# EAGLE design mainboard (EAGLE 6.4)
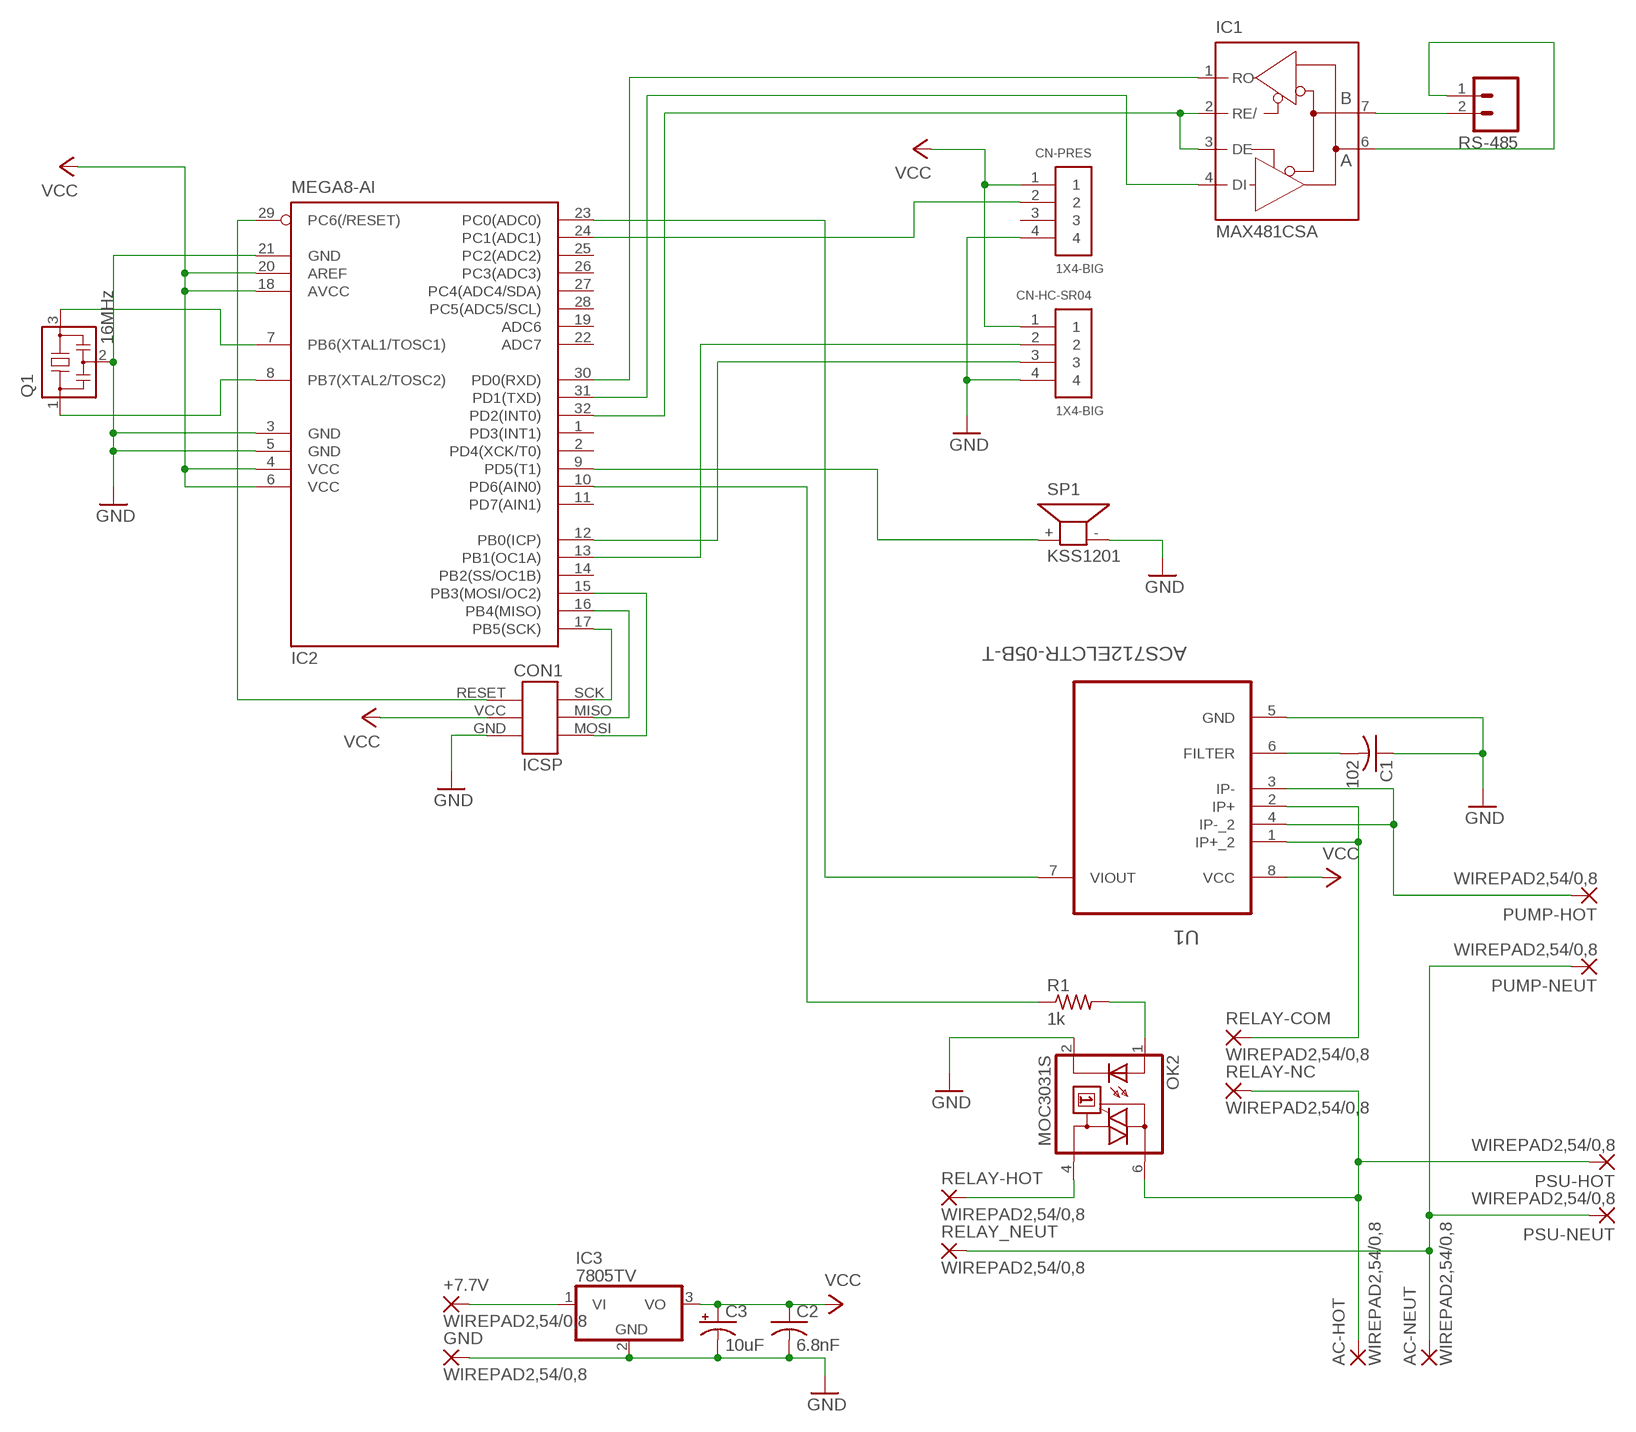
[diagram p0: schematic, sheet 1]

## Parts
+7.7V  WIREPAD2,54/0,8  [2,54/0,8]
AC-HOT  WIREPAD2,54/0,8  [2,54/0,8]
AC-NEUT  WIREPAD2,54/0,8  [2,54/0,8]
C1  102  C-US025-024X044  [C025-024X044]
C2  6.8nF  C-US050-024X044  [C050-024X044]
C3  10uF  CPOL-USE1.8-4  [E1,8-4]
CN-HC-SR04  1X4-BIG  [1X04-BIG]
CN-PRES  1X4-BIG  [1X04-BIG]
CON1  ICSP-HEADER  [ICSP-HEADER]
GND  WIREPAD2,54/0,8  [2,54/0,8]
IC1  MAX481CSA  [SO08]
IC2  MEGA8-AI  [TQFP32-08]
IC3  7805TV  [TO220V]
OK2  MOC3031S  [DIL6-SMD]
PSU-HOT  WIREPAD2,54/0,8  [2,54/0,8]
PSU-NEUT  WIREPAD2,54/0,8  [2,54/0,8]
PUMP-HOT  WIREPAD2,54/0,8  [2,54/0,8]
PUMP-NEUT  WIREPAD2,54/0,8  [2,54/0,8]
Q1  16MHz  RESONATOR  [RESONATOR]
R1  1k  R-US_R0603  [R0603]
RELAY-COM  WIREPAD2,54/0,8  [2,54/0,8]
RELAY-HOT  WIREPAD2,54/0,8  [2,54/0,8]
RELAY-NC  WIREPAD2,54/0,8  [2,54/0,8]
RELAY_NEUT  WIREPAD2,54/0,8  [2,54/0,8]
RS-485  M02  [02P]
SP1  KSS1201  [KSS1201]
U1  ACS712ELCTR-05B-T  [SOIC127P600X175-8N]

## Nets
GND: C1.1 C2.2 C3.- CN-HC-SR04.4 CN-PRES.4 CON1.GND GND.1(P) IC2.3(GND) IC2.5(GND) IC2.21(GND) IC3.2(GND) OK2.2(C) Q1.2 SP1.- U1.5(GND)
N$1: IC2.7(PB6(XTAL1/TOSC1)) Q1.3
N$2: IC2.8(PB7(XTAL2/TOSC2)) Q1.1
N$3: CON1.SCK IC2.17(PB5(SCK))
N$4: CON1.MISO IC2.16(PB4(MISO))
N$5: CON1.MOSI IC2.15(PB3(MOSI/OC2))
N$6: CON1.RESET IC2.29(PC6(/RESET))
N$7: C1.2 U1.6(FILTER)
N$8: PUMP-HOT.1(P) U1.3(IP-) U1.4(IP-_2)
N$9: +7.7V.1(P) IC3.1(VI)
N$10: AC-HOT.1(P) OK2.6(A2) PSU-HOT.1(P) RELAY-NC.1(P)
N$11: AC-NEUT.1(P) PSU-NEUT.1(P) PUMP-NEUT.1(P) RELAY_NEUT.1(P)
N$12: OK2.4(A1) RELAY-HOT.1(P)
N$13: IC2.9(PD5(T1)) SP1.+
N$14: IC2.23(PC0(ADC0)) U1.7(VIOUT)
N$15: OK2.1(A) R1.2
N$16: IC2.10(PD6(AIN0)) R1.1
N$17: CN-PRES.2 IC2.24(PC1(ADC1))
N$18: CN-HC-SR04.2 IC2.13(PB1(OC1A))
N$19: CN-HC-SR04.3 IC2.12(PB0(ICP))
N$20: IC1.7(B) RS-485.2
N$21: IC1.6(A) RS-485.1
N$22: IC1.2(RE/) IC1.3(DE) IC2.32(PD2(INT0))
N$23: IC1.1(RO) IC2.30(PD0(RXD))
N$24: IC1.4(DI) IC2.31(PD1(TXD))
RELAY-COM: RELAY-COM.1(P) U1.1(IP+_2) U1.2(IP+)
VCC: C2.1 C3.+ CN-HC-SR04.1 CN-PRES.1 CON1.VCC(+5V) IC2.4(VCC) IC2.6(VCC) IC2.18(AVCC) IC2.20(AREF) IC3.3(VO) U1.8(VCC)
Unconnected: CN-PRES.3 IC2.1(PD3(INT1)) IC2.2(PD4(XCK/T0)) IC2.11(PD7(AIN1)) IC2.14(PB2(SS/OC1B)) IC2.19(ADC6) IC2.22(ADC7) IC2.25(PC2(ADC2)) IC2.26(PC3(ADC3)) IC2.27(PC4(ADC4/SDA)) IC2.28(PC5(ADC5/SCL))

## Power pins joined to a net without a drawn wire
GND: IC1.5(GND)
VCC: IC1.8(VCC)

## Library data of the parts
+7.7V AC-HOT AC-NEUT GND PSU-HOT PSU-NEUT PUMP-HOT PUMP-NEUT RELAY-COM RELAY-HOT RELAY-NC RELAY_NEUT = wirepad:WIREPAD: Wire PAD connect wire on PCB
C1 C2 = adafruit:C-US: CAPACITOR, American symbol
C3 = adafruit:CPOL-US: POLARIZED CAPACITOR, American symbol
CN-HC-SR04 CN-PRES = adafruit:1X4: 4-pin connector
CON1 = serge:ICSP-HEADER
IC1 = maxim:MAX481CSA: RS485 TRANSEIVER; MF: MAXIM; MPN: MAX481CSA; OC_FARNELL: unknown; OC_NEWARK: 90C3817
IC2 = atmel:MEGA8: MICROCONTROLLER 8 Kbytes FLASH, 1 kbytes SRAM, 512 bytes EEPROM, USART, 6-channel 10 bit ADC, 2-channel 8 bit ADC Pin compatible with Atmega48, ATMega88, ATMega168 Source: avr.lbr; MPN: ATMEGA8-16AU; OC_FARNELL: 9171371; OC_NEWARK: 73M8863
IC3 = linear:78*: Positive VOLTAGE REGULATOR Source: http://cache.national.com/ds/LM/LM78L05.pdf http://www.fairchildsemi.com/ds/LM/LM7805.pdf
OK2 = optocoupler:MOC30*: 6-Pin DIP Zero-Cross Optoisolators Triac Driver Output (250/400 Volt Peak) Source: http://www.fairchildsemi.com/ds/MO/MOC3043-M.pdf; MF: FAIRCHILD SEMICONDUCTOR; MPN: MOC3031SM; OC_FARNELL: unknown; OC_NEWARK: 34C1335
Q1 = serge:RESONATOR
R1 = adafruit:R-US_: RESISTOR, American symbol
RS-485 = con-amp-quick:M02: AMP QUICK CONNECTOR; OC_FARNELL: unknown; OC_NEWARK: unknown
SP1 = buzzer:KSS1201: SPEAKER Source: Schukat; OC_FARNELL: unknown; OC_NEWARK: unknown
U1 = Allegro_By_element14_Batch_1:ACS712ELCTR-05B-T: Linear Current Sensor; MPN: ACS712ELCTR-05B-T; OC_FARNELL: 1329623; OC_NEWARK: 27M3644; PACKAGE: SOIC-8; SUPPLIER: Allegro

## Board
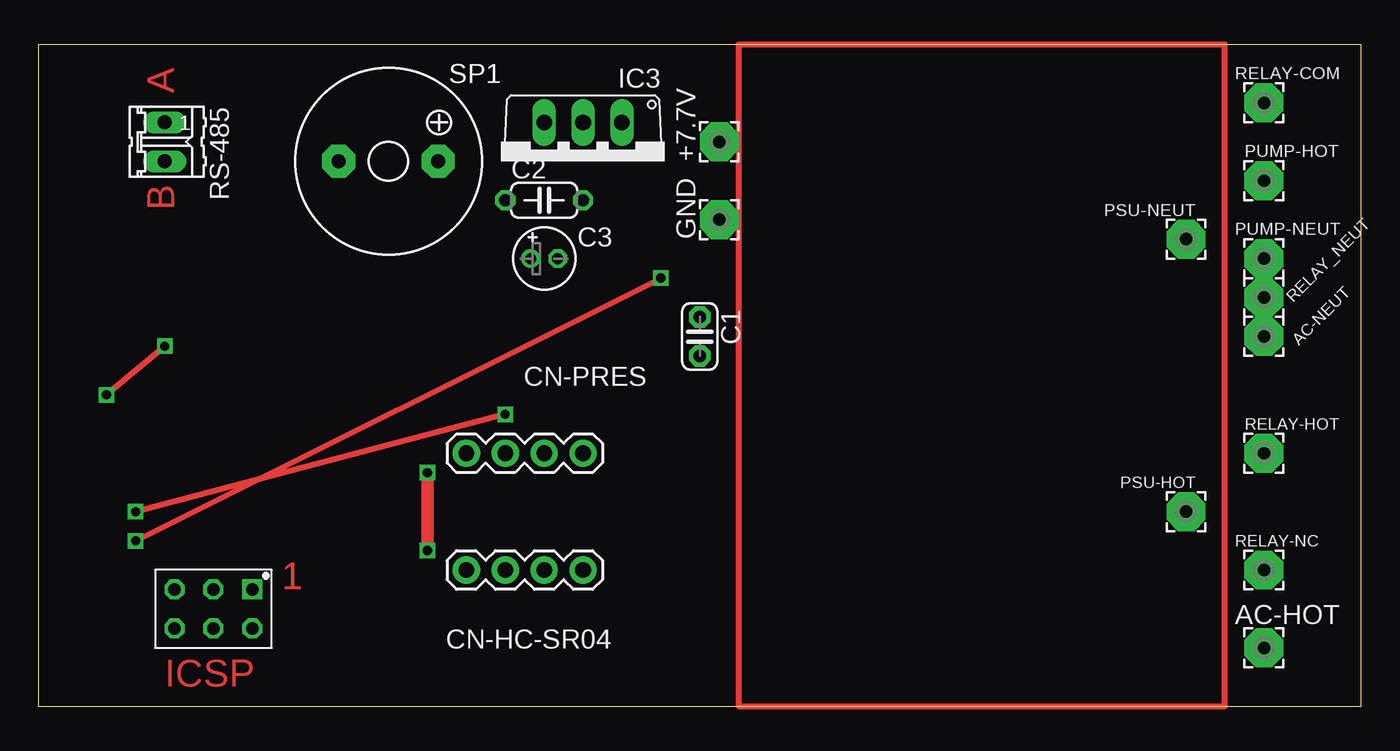
[diagram p1: board, top side]
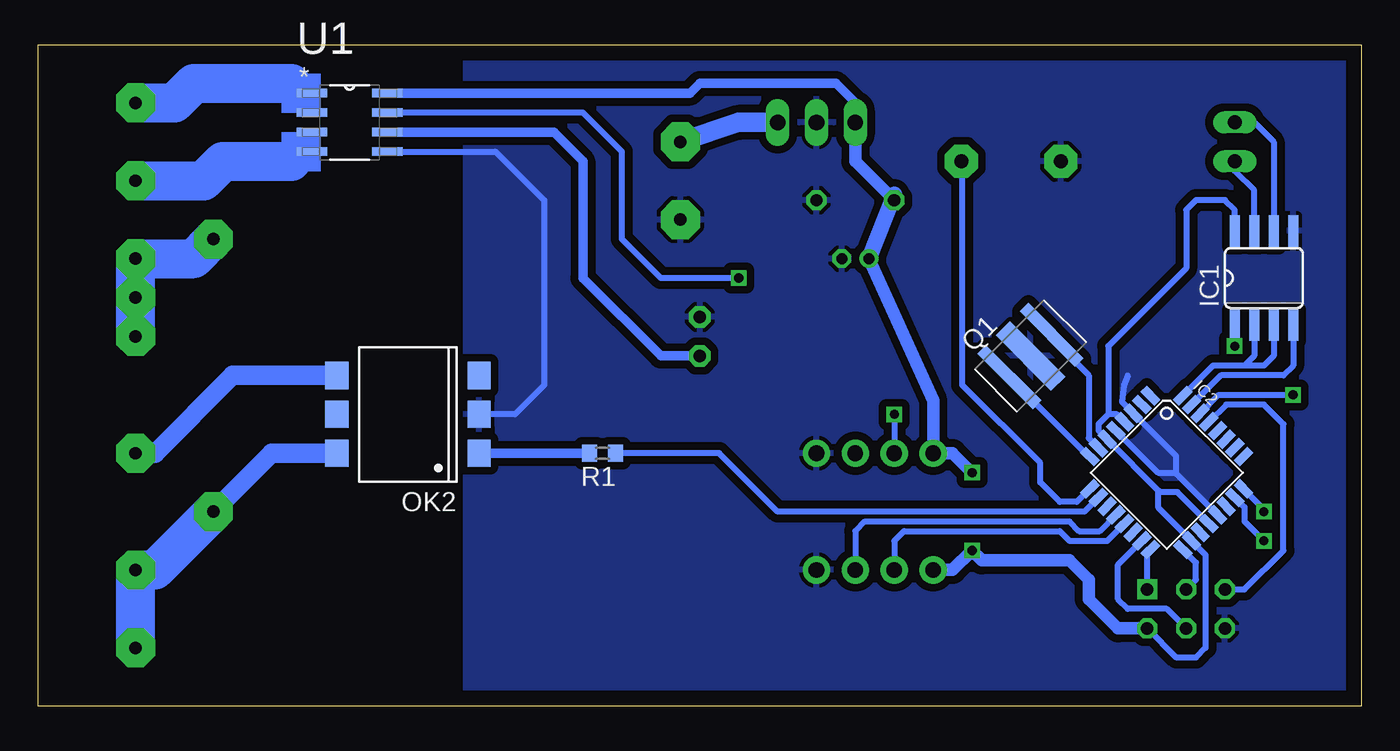
[diagram p2: board, bottom side, seen from below]

Size 86.36 x 43.18 mm. Coordinates in mm from the lower left corner, seen from the top.
Outline: 0,0 86.36,0 86.36,43.18 0,43.18 0,0
Copper layers (1*16): Top 0.035mm / dielectric 1.5mm / Bottom 0.035mm
Design rules "default *": minimum track width 10mil, minimum drill 24mil, track to track 20mil, track to pad 20mil, pad to pad 20mil, via to via 20mil, smd to smd 20mil, copper to edge 40mil, drill to drill 8mil, minimum pad ring 10mil, minimum via ring 8mil, stop-mask expansion 4mil, vias tented up to drill 0mil, thermal gap 10mil

### Footprints (pad centres in the part's own frame; a part is rotated, then mirrored left to right if it is on the bottom)
2,54/0,8 = drill 0.813 pad 2.54 octagon: 1 0,0
C025-024X044 = drill 0.813 pad 1.422 octagon: 1 -1.27,0; 2 1.27,0
C050-024X044 = drill 0.813 octagon: 1 -2.54,0; 2 2.54,0
E1,8-4 = drill 0.711 pad 1.168: + -0.889,0 | drill 0.711 pad 1.168 octagon: - 0.889,0
1X04-BIG = drill 1.016 pad 1.778: 1 0,0; 2 2.54,0; 3 5.08,0; 4 7.62,0
ICSP-HEADER = drill 0.8 octagon: GND 1.27,-3.81; MOSI 1.27,-1.27; RESET -1.27,-3.81; SCK -1.27,-1.27; VCC 1.27,1.27 | drill 0.8 square: MISO -1.27,1.27
SO08 = smd 0.66 x 2.032: 1 -1.905,-3.073; 2 -0.635,-3.073; 3 0.635,-3.073; 4 1.905,-3.073; 5 1.905,3.073; 6 0.635,3.073; 7 -0.635,3.073; 8 -1.905,3.073
TQFP32-08 = smd 1.27 x 0.559: 1 -4.293,2.8; 2 -4.293,2; 3 -4.293,1.2; 4 -4.293,0.4; 5 -4.293,-0.4; 6 -4.293,-1.2; 7 -4.293,-2; 8 -4.293,-2.8; 17 4.293,-2.8; 18 4.293,-2; 19 4.293,-1.2; 20 4.293,-0.4; 21 4.293,0.4; 22 4.293,1.2; 23 4.293,2; 24 4.293,2.8 | smd 0.559 x 1.27: 9 -2.8,-4.293; 10 -2,-4.293; 11 -1.2,-4.293; 12 -0.4,-4.293; 13 0.4,-4.293; 14 1.2,-4.293; 15 2,-4.293; 16 2.8,-4.293; 25 2.8,4.293; 26 2,4.293; 27 1.2,4.293; 28 0.4,4.293; 29 -0.4,4.293; 30 -1.2,4.293; 31 -2,4.293; 32 -2.8,4.293
TO220V = drill 1.016 long: 1 -2.54,-2.54; 2 0,-2.54; 3 2.54,-2.54
DIL6-SMD = smd 1.78 x 1.52: 1 -2.54,-4.645; 2 0,-4.645; 3 2.54,-4.645; 4 2.54,4.645; 5 0,4.645; 6 -2.54,4.645
RESONATOR = smd 0.8 x 5.1: 1 -1.95,0; 3 1.95,0 | smd 1.3 x 5.1: 2 0,0
R0603 = smd 1 x 1.1: 1 -0.85,0; 2 0.85,0
02P = drill 0.914 long: 1 -1.27,0; 2 1.27,0
KSS1201 = drill 0.914 pad 2.159 octagon: + 3.251,0; - -3.251,0
SOIC127P600X175-8N = smd 1.981 x 0.559: 1 -2.464,1.905; 2 -2.464,0.635; 3 -2.464,-0.635; 4 -2.464,-1.905; 5 2.464,-1.905; 6 2.464,-0.635; 7 2.464,0.635; 8 2.464,1.905

### Placement (x,y rotation side)
+7.7V  44.45,36.83 90 top
AC-HOT  80.01,3.81 0 top
AC-NEUT  80.01,24.13 0 top
C1  43.18,24.13 270 top
C2  33.02,33.02 0 top
C3  33.02,29.21 0 top
CN-HC-SR04  27.94,8.89 0 top
CN-PRES  27.94,16.51 0 top
CON1  12.7,6.35 270 top
GND  44.45,31.75 90 top
IC1  6.35,27.94 0 bottom
IC2  12.7,15.24 315 bottom
IC3  35.56,35.56 180 top
OK2  62.23,19.05 90 bottom
PSU-HOT  74.93,12.7 90 top
PSU-NEUT  74.93,30.48 90 top
PUMP-HOT  80.01,34.29 0 top
PUMP-NEUT  80.01,29.21 0 top
Q1  21.59,22.86 45 bottom
R1  49.53,16.51 180 bottom
RELAY-COM  80.01,39.37 0 top
RELAY-HOT  80.01,16.51 0 top
RELAY-NC  80.01,8.89 0 top
RELAY_NEUT  80.01,26.67 0 top
RS-485  8.26,36.83 270 top
SP1  22.86,35.56 0 top
U1  66.04,38.1 0 bottom

### Tracks (layer width: path | path; a pad name or v marks a point on that pad's centre or on a via)
GND
  Bottom 0.406: IC2.5 13.27,15.24 12.13,15.24 12.1,15.21 | 12.1,15.21 IC2.21 | 12.1,15.21 12.1,16.34 IC2.3 15.62,19.86 15.49,20.95 15.24,21.59 | U1.5 56.52,36.2 53.34,33.02 53.34,20.95 55.24,19.05 OK2.2
  pour Bottom: 0,43.18 0,0 58.42,0 58.42,43.18
N$1
  Bottom 0.406: IC2.7 17.78,17.49 17.78,21.59 20.21,24.02 Q1.3
N$2
  Bottom 0.406: IC2.8 17.78,16.3 Q1.1
N$3
  Bottom 0.406: CON1.SCK 10.79,8.26 10.79,9.38 IC2.17
N$4
  Bottom 0.406: CON1.MISO 13.97,10.01 IC2.16
N$5
  Bottom 0.406: CON1.MOSI 12.7,6.35 15.24,6.35 15.88,6.99 15.88,9.24 IC2.15
N$6
  Bottom 0.406: CON1.RESET 7.62,7.62 5.08,10.16 5.08,18.41 6.35,19.68 8.82,19.68 IC2.29
N$7
  Bottom 0.61: U1.6 52.7,37.47 50.8,35.56 50.8,27.94 45.72,22.86 C1.2
N$8
  Bottom 0.61: U1.3 U1.4 69.14,35.56 69.85,35.56
  Bottom 2.54: PUMP-HOT.1 75.56,34.29 74.3,35.56 69.85,35.56
N$9
  Bottom 1.27: IC3.1 40.64,38.1 +7.7V.1
N$10
  Bottom 1.27: OK2.6 71.12,16.51 PSU-HOT.1
  Bottom 2.54: AC-HOT.1 RELAY-NC.1 78.74,8.89 PSU-HOT.1
N$11
  Bottom 2.54: AC-NEUT.1 RELAY_NEUT.1 PUMP-NEUT.1 76.2,29.21 PSU-NEUT.1
N$12
  Bottom 1.27: RELAY-HOT.1 78.74,16.51 73.66,21.59 OK2.4
N$13
  Bottom 0.406: IC2.9 18.57,13.34 19.68,13.34 20.95,14.61 20.95,15.88 26.04,20.95 26.04,35 SP1.+
N$14  (via drill 0.6)
  Top 0.406: v6.35,10.79 v40.64,27.94
  Bottom 0.406: IC2.23 7.62,12.99 7.62,12.06 v6.35,10.79 | U1.7 50.8,38.73 48.26,36.2 48.26,30.48 45.72,27.94 v40.64,27.94
N$15
  Bottom 0.61: OK2.1 R1.2
N$16
  Bottom 0.406: IC2.10 18.07,12.7 38.1,12.7 41.91,16.51 R1.1
N$17  (via drill 0.6)
  Top 0.406: v30.48,19.05 v6.35,12.7
  Bottom 0.406: v6.35,12.7 6.35,12.85 IC2.24 | v30.48,19.05 CN-PRES.2
N$18
  Bottom 0.406: IC2.13 16.58,10.79 19.05,10.79 19.68,11.43 29.84,11.43 30.48,10.79 CN-HC-SR04.2
N$19
  Bottom 0.406: IC2.12 17.08,11.43 18.41,11.43 19.05,12.06 32.38,12.06 33.02,11.43 CN-HC-SR04.3
N$20
  Bottom 0.406: IC1.7 6.99,33.66 8.26,34.92 RS-485.2
N$21
  Bottom 0.406: RS-485.1 6.99,38.1 5.71,36.83 IC1.6
N$22
  Bottom 0.406: IC1.3 5.71,22.86 6.35,22.23 7.62,22.23 | 7.62,22.23 9.68,22.23 IC2.32 | IC1.2 6.99,22.86 7.62,22.23
N$23  (via drill 0.6)
  Top 0.406: v4.45,20.32 v8.26,23.5
  Bottom 0.406: IC2.30 9.32,20.32 v4.45,20.32 | v8.26,23.5 IC1.1
N$24
  Bottom 0.406: IC1.4 4.45,22.23 5.08,21.59 9.18,21.59 IC2.31
N$25
  Top 0.406: 45.72,43.18 45.72,0 77.47,0 77.47,43.18 45.72,43.18
RELAY-COM
  Bottom 0.61: U1.2 U1.1 69.22,40.01 69.85,40.64
  Bottom 2.54: RELAY-COM.1 77.47,39.37 76.2,40.64 69.85,40.64
VCC  (via drill 0.6)
  Top 0.813: v25.4,10.16 v25.4,15.24
  Bottom 0.406: IC2.20 12,13.97 13.13,13.97 13.23,14.07 | 13.23,14.07 IC2.6 17.14,17.99 17.14,18.41 16.51,19.05 | 13.23,14.07 13.23,12.94 IC2.18 10.16,9.87 10.16,3.81 10.79,3.17 12.06,3.17 CON1.VCC | IC2.4 15.94,19.05 16.51,19.05 | 16.51,19.05 16.51,23.5 11.43,28.57 11.43,32.38 10.79,33.02 8.89,33.02 8.26,32.38 IC1.8
  Bottom 0.61: U1.8 43.81,40.01 43.18,40.64 34.29,40.64 33.02,39.37 IC3.3
  Bottom 0.813: CN-HC-SR04.1 26.67,8.89 v25.4,10.16 24.77,9.53 19.05,9.53 17.78,8.26 17.78,6.99 15.88,5.08 CON1.VCC | v25.4,15.24 26.67,16.51 CN-PRES.1 27.94,19.94 C3.+ | IC3.3 33.02,35.56 C2.1
  Bottom 1.016: C2.1 30.48,33.4 C3.+
(copper drawn outside any net)
  shapes: Bottom area x2

### Text on the board
Top: A | B | 1 | ICSP